# EAGLE design schematic (EAGLE 8.0.0)
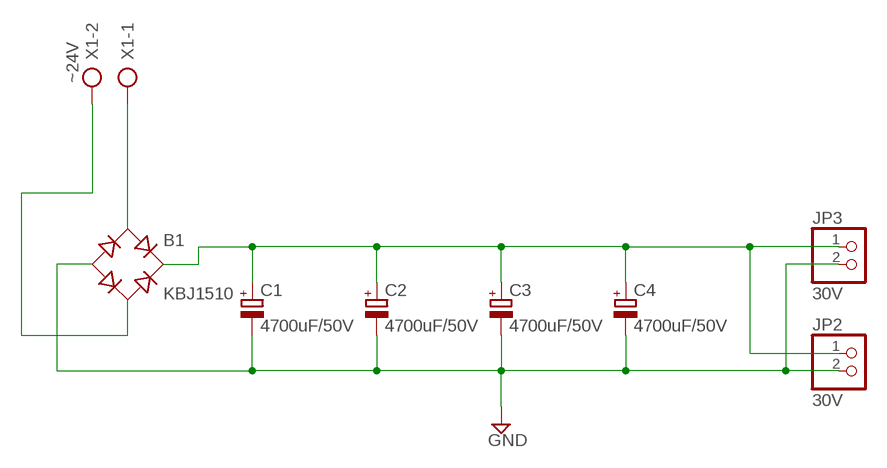
[diagram p0: schematic, sheet 1]

## Parts
B1  KBJ1510  RECTIFIER-FB32  [FB32]
C1  4700uF/50V  CPOL-EUE10-20  [EB20D]
C2  4700uF/50V  CPOL-EUE10-20  [EB20D]
C3  4700uF/50V  CPOL-EUE10-20  [EB20D]
C4  4700uF/50V  CPOL-EUE10-20  [EB20D]
JP2  30V  PINHD-1X2  [1X02]
JP3  30V  PINHD-1X2  [1X02]
X1  ~24V  AK500/2  [AK500/2]

## Nets
GND: B1.- C1.- C2.- C3.- C4.- JP2.2 JP3.2
N$1: B1.AC2 X1.2
N$2: B1.AC1 X1.1
N$3: B1.+ C1.+ C2.+ C3.+ C4.+ JP2.1 JP3.1

## Library data of the parts
B1 = rectifier:RECTIFIER-: Rectifier
C1-C4 = rcl:CPOL-EU: POLARIZED CAPACITOR, European symbol
JP2 JP3 = pinhead:PINHD-1X2: PIN HEADER
X1 = con-ptr500:AK500/2: CONNECTOR; OC_FARNELL: unknown; OC_NEWARK: unknown

## Board
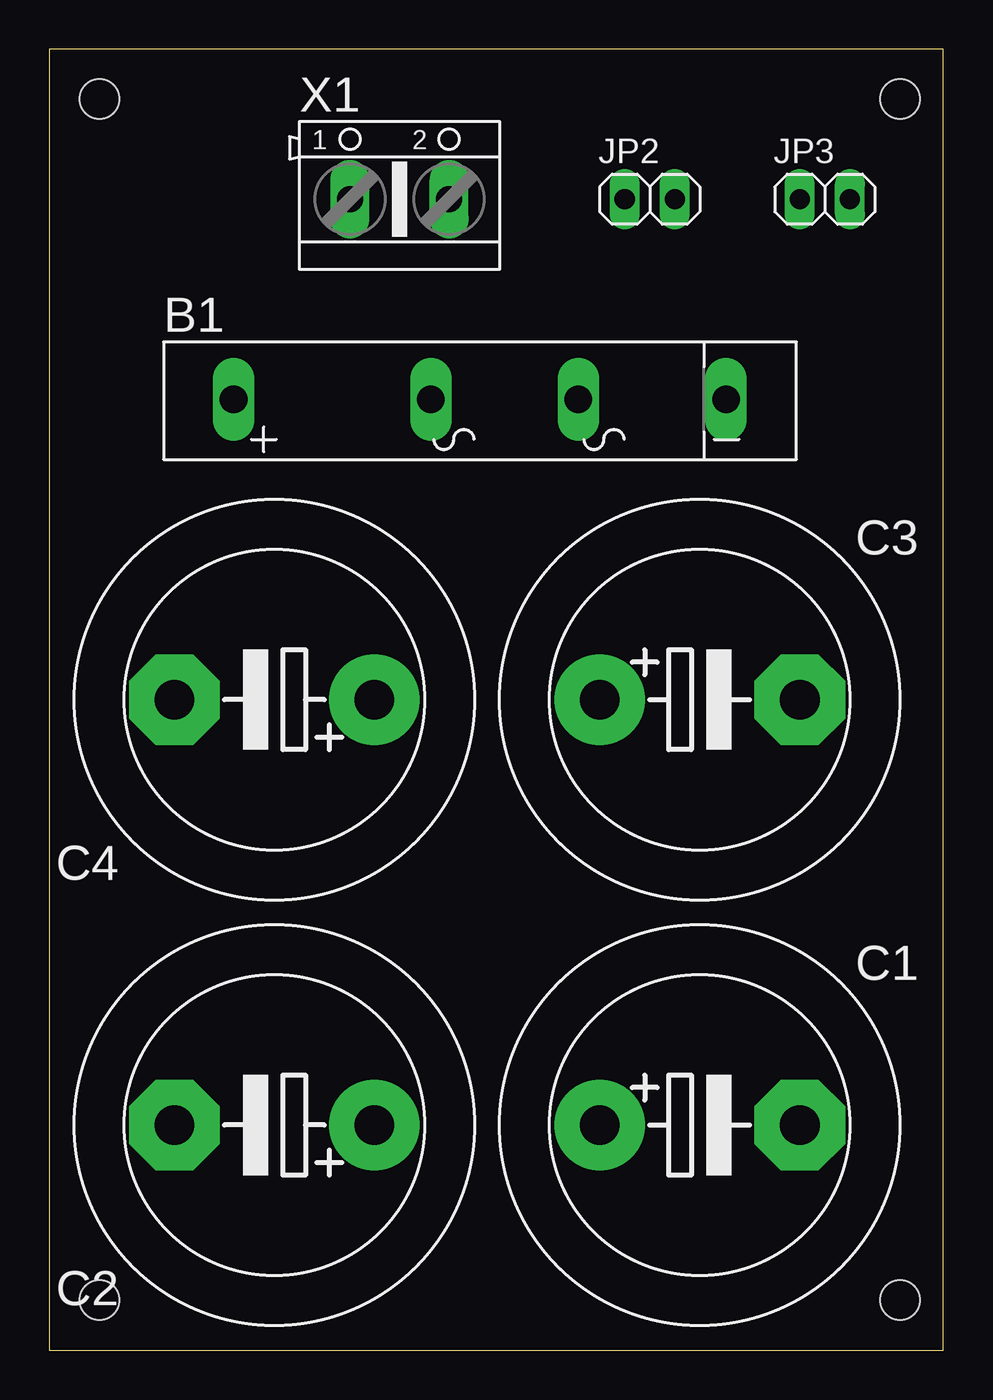
[diagram p1: board, top side]
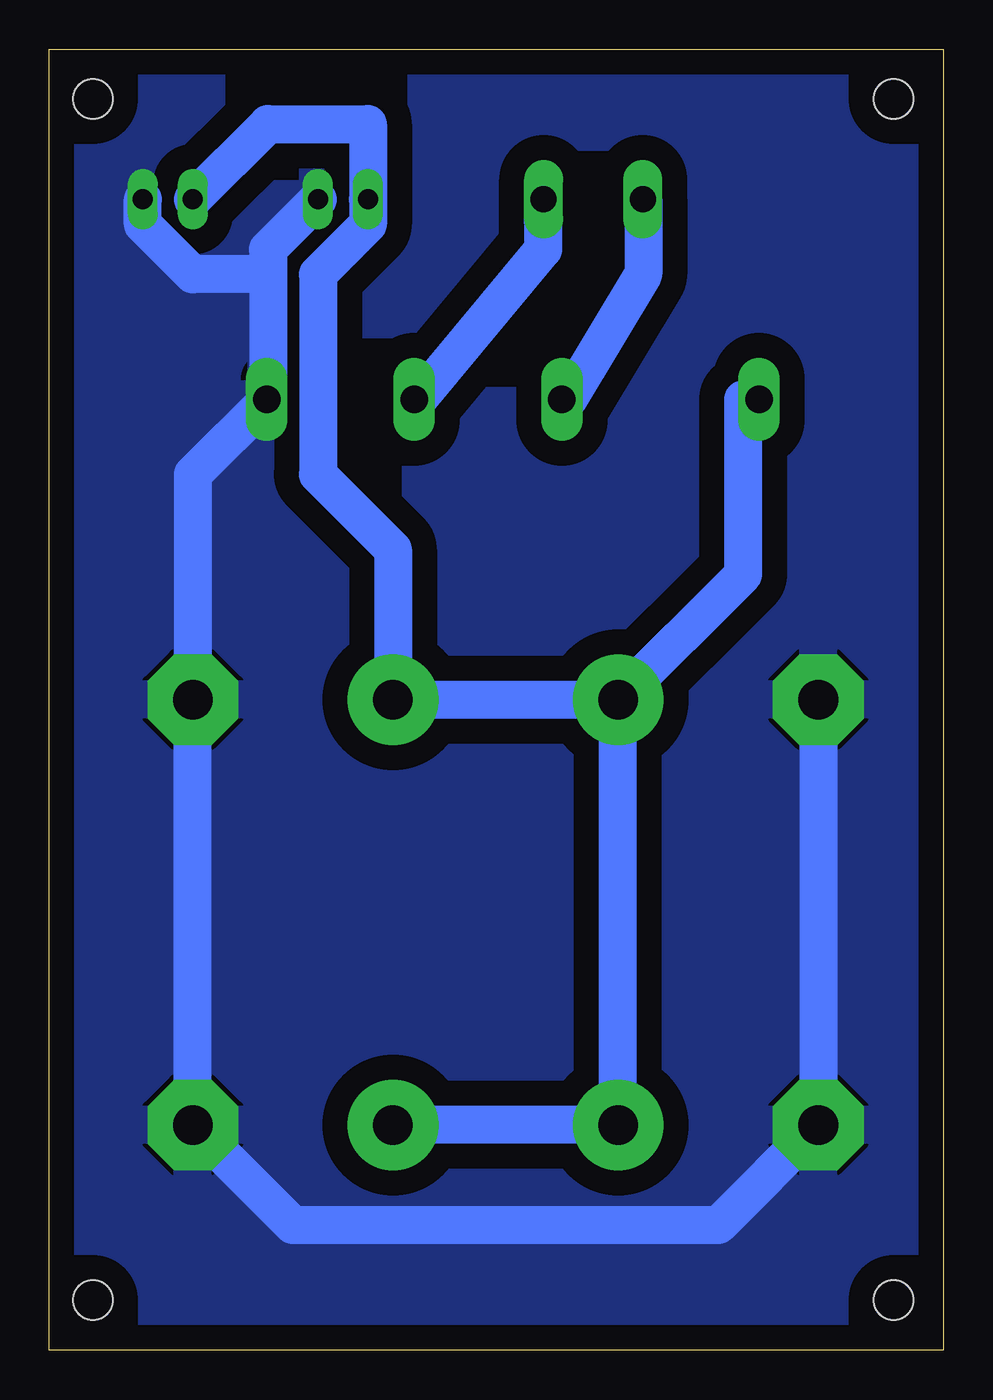
[diagram p2: board, bottom side, seen from below]

Size 45.39 x 66.03 mm. Coordinates in mm from the lower left corner, seen from the top.
Outline: 0,0 45.39,0 45.39,66.03 0,66.03 0,0
Copper layers (1*16): Top 0.035mm / dielectric 1.5mm / Bottom 0.035mm
Design rules "default": minimum track width 10mil, minimum drill 24mil, track to track 8mil, track to pad 8mil, pad to pad 8mil, via to via 8mil, smd to smd 8mil, copper to edge 40mil, drill to drill 8mil, minimum pad ring 10mil, minimum via ring 8mil, stop-mask expansion 4mil, vias tented up to drill 0mil, thermal gap 10mil
Holes 2 mm at 2.54,63.5 43.18,63.5 43.18,2.54 2.54,2.54

### Footprints (pad centres in the part's own frame; a part is rotated, then mirrored left to right if it is on the bottom)
FB32 = drill 1.397 long: + -13.5,0; - 11.494,0; AC1 -3.492,0; AC2 4.001,0
EB20D = drill 2.007 pad 4.597: + -5.08,0 | drill 2.007 pad 4.597 octagon: - 5.08,0
1X02 = drill 1.016 long: 1 -1.27,0; 2 1.27,0
AK500/2 = drill 1.321 long: 1 -2.515,0; 2 2.515,0

### Placement (x,y rotation side)
B1  22.86,48.26 0 top
C1  33.02,11.43 0 top
C2  11.43,11.43 180 top
C3  33.02,33.02 0 top
C4  11.43,33.02 180 top
JP2  30.48,58.42 0 top
JP3  39.37,58.42 0 top
X1  17.78,58.42 0 top

### Tracks (layer width: path | path; a pad name or v marks a point on that pad's centre or on a via)
GND
  Bottom 1.93: C4.- C2.- 11.43,6.35 33.02,6.35 C1.- C3.- 38.1,44.45 34.29,48.26 | 34.29,54.61 34.29,55.88 JP2.2 | 34.29,54.61 34.29,48.26 | JP3.2 40.64,57.15 38.1,54.61 34.29,54.61 | 34.29,48.26 B1.-
  pour Bottom (isolate 1.27): 0,66.04 45.72,66.04 45.72,0 0,0
N$1
  Bottom 1.93: B1.AC2 26.67,48.26 20.32,55.88 20.32,57.15 X1.2
N$2
  Bottom 1.93: X1.1 15.24,58.42 15.24,54.61 19.05,48.26 B1.AC1
N$3
  Bottom 1.93: JP3.1 34.29,62.23 29.21,62.23 JP2.1 29.21,57.15 31.75,54.61 31.75,44.45 27.94,40.64 C3.+ C4.+ | C4.+ C2.+ C1.+ | C4.+ 10.16,39.37 10.16,48.26 B1.+